# Altium schematic sheet Plaquinha.SchDoc
size A4
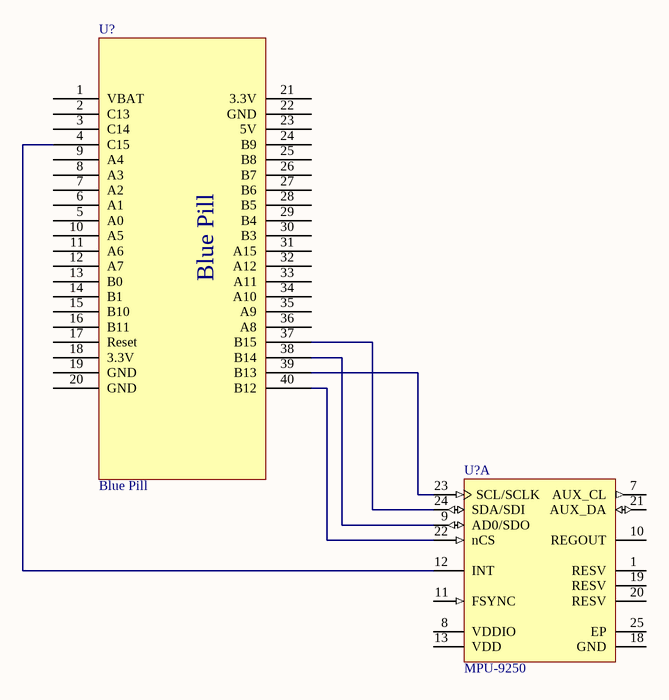
[diagram p0: Plaquinha.SchDoc]

## Parts
(Parts that share a designator on the sheet are numbered #1, #2 ... from top to bottom, then left to right.)
U?#1  Blue Pill  [blue pill]
U?#2  MPU-9250  [INSE-QFN-24-1700X1540TP_L]  (part A of 2)

## Nets
NetU?#1_4: U?#1.4(C15) U?#2.12(INT)
NetU?#1_37: U?#1.37(B15) U?#2.24(SDA/SDI)
NetU?#1_38: U?#1.38(B14) U?#2.9(AD0/SDO)
NetU?#1_39: U?#1.39(B13) U?#2.23(SCL/SCLK)
NetU?#1_40: U?#1.40(B12) U?#2.22(nCS)

Not connected (* = marked no-connect by the designer): U?#1 1(VBAT) 2(C13) 3(C14) 5(A0) 6(A1) 7(A2) 8(A3) 9(A4) 10(A5) 11(A6) 12(A7) 13(B0) 14(B1) 15(B10) 16(B11) 17(Reset) 18(3.3V) 19(GND) 20(GND) 21(3.3V) 22(GND) 23(5V) 24(B9) 25(B8) 26(B7) 27(B6) 28(B5) 29(B4) 30(B3) 31(A15) 32(A12) 33(A11) 34(A10) 35(A9) 36(A8); U?#2 1(RESV) 7(AUX_CL) 8(VDDIO) 10(REGOUT) 11(FSYNC) 13(VDD) 18(GND) 19(RESV) 20(RESV) 21(AUX_DA) 25(EP)

## Library data of the parts
U?#2 = CMP-2100-03657-1: 9-axis MotionTracking device, 2.4 to 3,6 V, -40 to 85 degC, 24-Pin QFN, RoHS, Tape and Reel; Manufacturer: InvenSense; Max Supply Voltage: 3.6V; Min Supply Voltage: 2.4V; Package Reference: QFN-24; Package Quantity: 1; Datasheet Version: Rev. 1.0, 01/2014; Case/Package: QFN; Package Description: 24-Pin Quad Flat No-lead Package, Body 3 x 3 mm, Pitch 0.4 mm; Datasheet URL: http://datasheet.octopart.com/MPU-9250-InvenSense-datasheet-21859386.pdf; RoHSCompliant: true; Max Operating Temperature: 85degC; Height: 1mm; Mount: SurfaceMount; Manufacturer URL: http://www.invensense.com/; Width: 3.1mm; Min Operating Temperature: -40degC; Length: 3.1mm